# Altium schematic sheet football_main_board_2016.SchDoc
size A3
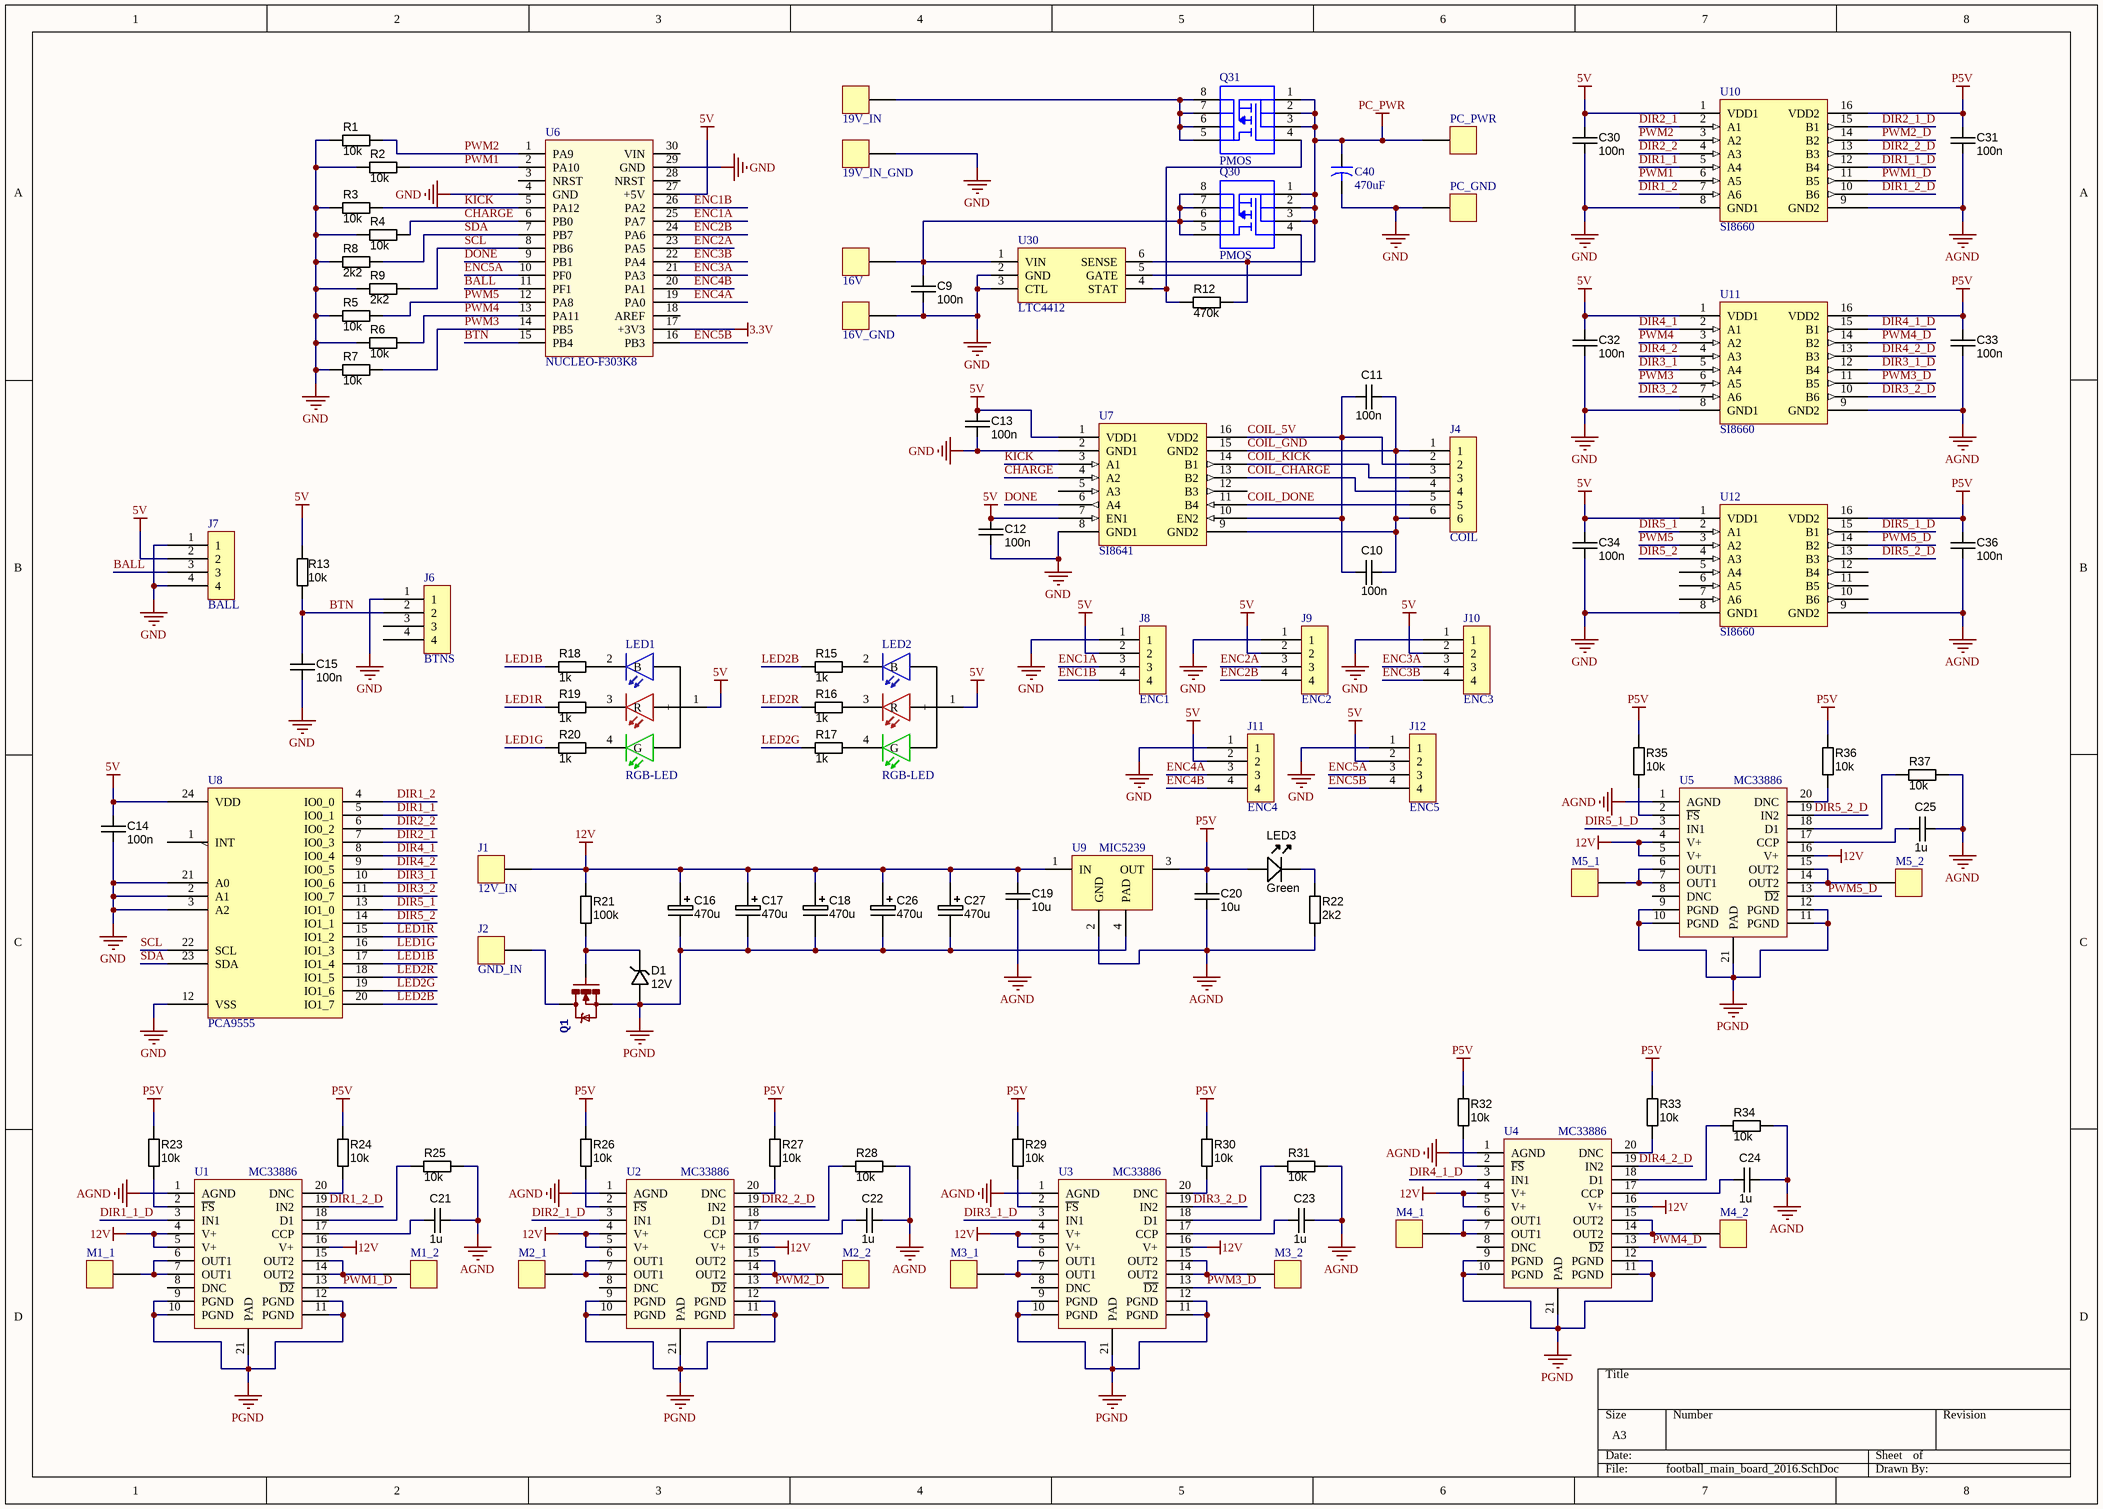
[diagram p0: football_main_board_2016.SchDoc]

## Parts
16V  HEADER-1  [POWER-PAD-4x3]  (value not drawn)
16V_GND  HEADER-1  [POWER-PAD-4x3]  (value not drawn)
19V_IN  HEADER-1  [POWER-PAD-4x3]  (value not drawn)
19V_IN_GND  HEADER-1  [POWER-PAD-4x3]  (value not drawn)
C9  100n  [CAPC1608X90N]
C10  100n  [CAPC1608X90N]
C11  100n  [CAPC1608X90N]
C12  100n  [CAPC1608X90N]
C13  100n  [CAPC1608X90N]
C14  100n  [CAPC1608X90N]
C15  100n  [CAPC1608X90N]
C16  470u  [CAP-LEADED-SMD-5]
C17  470u  [CAP-LEADED-SMD-5]
C18  470u  [CAP-LEADED-SMD-5]
C19  10u  [CAPC3216X180N]
C20  10u  [CAPC3216X180N]
C21  1u  [CAPC1608X90N]
C22  1u  [CAPC1608X90N]
C23  1u  [CAPC1608X90N]
C24  1u  [CAPC1608X90N]
C25  1u  [CAPC1608X90N]
C26  470u  [CAP-LEADED-SMD-5]
C27  470u  [CAP-LEADED-SMD-5]
C30  100n  [CAPC1608X90N]
C31  100n  [CAPC1608X90N]
C32  100n  [CAPC1608X90N]
C33  100n  [CAPC1608X90N]
C34  100n  [CAPC1608X90N]
C36  100n  [CAPC1608X90N]
C40  470uF  [CAPR5-4X5]
D1  12V  [SOD123]
J1  12V_IN  [POWER-PAD]
J2  GND_IN  [POWER-PAD]
J4  COIL  [MICRO-MATCH-6]
J6  BTNS  [MICRO-MATCH-4]
J7  BALL  [MICRO-MATCH-4]
J8  ENC1  [MICRO-MATCH-4]
J9  ENC2  [MICRO-MATCH-4]
J10  ENC3  [MICRO-MATCH-4]
J11  ENC4  [MICRO-MATCH-4]
J12  ENC5  [MICRO-MATCH-4]
LED1  RGB-LED  [RGB-LED]
LED2  RGB-LED  [RGB-LED]
LED3  Green  [LED-0603-GREEN]
M1_1  HEADER-1  [POWER-PAD-4x3]  (value not drawn)
M1_2  HEADER-1  [POWER-PAD-4x3]  (value not drawn)
M2_1  HEADER-1  [POWER-PAD-4x3]  (value not drawn)
M2_2  HEADER-1  [POWER-PAD-4x3]  (value not drawn)
M3_1  HEADER-1  [POWER-PAD-4x3]  (value not drawn)
M3_2  HEADER-1  [POWER-PAD-4x3]  (value not drawn)
M4_1  HEADER-1  [POWER-PAD-4x3]  (value not drawn)
M4_2  HEADER-1  [POWER-PAD-4x3]  (value not drawn)
M5_1  HEADER-1  [POWER-PAD-4x3]  (value not drawn)
M5_2  HEADER-1  [POWER-PAD-4x3]  (value not drawn)
PC_GND  HEADER-1  [POWER-PAD-4x3]  (value not drawn)
PC_PWR  HEADER-1  [POWER-PAD-4x3]  (value not drawn)
Q1  MOSFET-N  [SOT669]  (value not drawn)
Q30  PMOS  [SO8]
Q31  PMOS  [SO8]
R1  10k  [RESC1608X55N]
R2  10k  [RESC1608X55N]
R3  10k  [RESC1608X55N]
R4  10k  [RESC1608X55N]
R5  10k  [RESC1608X55N]
R6  10k  [RESC1608X55N]
R7  10k  [RESC1608X55N]
R8  2k2  [RESC1608X55N]
R9  2k2  [RESC1608X55N]
R12  470k  [RESC1608N_ZERO]
R13  10k  [RESC1608N_ZERO]
R15  1k  [RESC1608N_ZERO]
R16  1k  [RESC1608N_ZERO]
R17  1k  [RESC1608N_ZERO]
R18  1k  [RESC1608N_ZERO]
R19  1k  [RESC1608N_ZERO]
R20  1k  [RESC1608N_ZERO]
R21  100k  [RESC1608X55N]
R22  2k2  [RESC1608X55N]
R23  10k  [RESC1608X55N]
R24  10k  [RESC1608X55N]
R25  10k  [RESC1608X55N]
R26  10k  [RESC1608X55N]
R27  10k  [RESC1608X55N]
R28  10k  [RESC1608X55N]
R29  10k  [RESC1608X55N]
R30  10k  [RESC1608X55N]
R31  10k  [RESC1608X55N]
R32  10k  [RESC1608X55N]
R33  10k  [RESC1608X55N]
R34  10k  [RESC1608X55N]
R35  10k  [RESC1608X55N]
R36  10k  [RESC1608X55N]
R37  10k  [RESC1608X55N]
U1  MC33886  [MC33886]
U2  MC33886  [MC33886]
U3  MC33886  [MC33886]
U4  MC33886  [MC33886]
U5  MC33886  [MC33886]
U6  NUCLEO-F303K8  [NUCLEO-F303K8]
U7  SI8641  [SOIC16]
U8  PCA9555  [TSSOP24]
U9  MIC5239  [SOT230P700X180-4N]
U10  SI8660  [SOIC16]
U11  SI8660  [SOIC16]
U12  SI8660  [SOIC16]
U30  LTC4412  [TSOT-23-6]

## Nets
3.3V: U6.17(+3V3)
5V: C12.2 C13.1 C14.2 C30.1 C32.1 C34.1 J7.2 J8.2 J9.2 J10.2 J11.2 J12.2 LED1.1(+) LED2.1(+) R13.2 U6.27(+5V) U7.1(VDD1) U7.7(EN1) U8.24(VDD) U10.1(VDD1) U11.1(VDD1) U12.1(VDD1)
12V: C16.1 C17.1 C18.1 C19.1 C26.1 C27.1 J1.1 R21.1 U1.4(V+) U1.5(V+) U1.16(V+) U2.4(V+) U2.5(V+) U2.16(V+) U3.4(V+) U3.5(V+) U3.16(V+) U4.4(V+) U4.5(V+) U4.16(V+) U5.4(V+) U5.5(V+) U5.16(V+) U9.1(IN)
AGND: C19.2 C20.2 C21.2 C22.2 C23.2 C24.2 C25.2 C31.2 C33.2 C36.2 R22.2 R25.2 R28.2 R31.2 R34.2 R37.2 U1.1(AGND) U2.1(AGND) U3.1(AGND) U4.1(AGND) U5.1(AGND) U9.2(GND) U10.9(GND2) U11.9(GND2) U12.9(GND2)
GND: 16V_GND.1 19V_IN_GND.1 C9.2 C12.1 C13.2 C14.1 C15.2 C30.2 C32.2 C34.2 C40.2 J6.1 J7.1 J7.4 J8.1 J9.1 J10.1 J11.1 J12.1 PC_GND.1 R1.1 R2.1 R3.1 R4.1 R5.1 R6.1 R7.1 R8.1 R9.1 U6.4(GND) U6.29(GND) U7.2(GND1) U7.8(GND1) U8.2(A1) U8.3(A2) U8.12(VSS) U8.21(A0) U10.8(GND1) U11.8(GND1) U12.8(GND1) U30.2(GND) U30.3(CTL)
P5V: C20.1 C31.1 C33.1 C36.1 LED3.A R23.1 R24.1 R26.1 R27.1 R29.1 R30.1 R32.1 R33.1 R35.1 R36.1 U9.3(OUT) U10.16(VDD2) U11.16(VDD2) U12.16(VDD2)
PC_PWR: C40.1 PC_PWR.1 Q30.1 Q30.2 Q30.3 Q31.1 Q31.2 Q31.3 R12.1 U30.6(SENSE)
PGND: C16.2 C17.2 C18.2 C26.2 C27.2 D1.A Q1.S U1.9(PGND) U1.10(PGND) U1.11(PGND) U1.12(PGND) U1.21(PAD) U2.9(PGND) U2.10(PGND) U2.11(PGND) U2.12(PGND) U2.21(PAD) U3.9(PGND) U3.10(PGND) U3.11(PGND) U3.12(PGND) U3.21(PAD) U4.9(PGND) U4.10(PGND) U4.11(PGND) U4.12(PGND) U4.21(PAD) U5.9(PGND) U5.10(PGND) U5.11(PGND) U5.12(PGND) U5.21(PAD) U9.4(PAD)
BALL: J7.3 U6.11(PF1)
BTN: C15.1 J6.2 R13.1 U6.15(PB4)
CHARGE: R4.2 U6.6(PB0) U7.4(A2)
COIL_5V: C10.1 C11.1 J4.2 U7.10(EN2) U7.16(VDD2)
COIL_CHARGE: J4.4 U7.13(B2)
COIL_DONE: J4.5 U7.11(B4)
COIL_GND: C10.2 C11.2 J4.1 J4.6 U7.9(GND2) U7.15(GND2)
COIL_KICK: J4.3 U7.14(B1)
DIR1_1: U8.5(IO0_1) U10.5(A4)
DIR1_1_D: U1.3(IN1) U10.12(B4)
DIR1_2: U8.4(IO0_0) U10.7(A6)
DIR1_2_D: U1.19(IN2) U10.10(B6)
DIR2_1: U8.7(IO0_3) U10.2(A1)
DIR2_1_D: U2.3(IN1) U10.15(B1)
DIR2_2: U8.6(IO0_2) U10.4(A3)
DIR2_2_D: U2.19(IN2) U10.13(B3)
DIR3_1: U8.10(IO0_6) U11.5(A4)
DIR3_1_D: U3.3(IN1) U11.12(B4)
DIR3_2: U8.11(IO0_7) U11.7(A6)
DIR3_2_D: U3.19(IN2) U11.10(B6)
DIR4_1: U8.8(IO0_4) U11.2(A1)
DIR4_1_D: U4.3(IN1) U11.15(B1)
DIR4_2: U8.9(IO0_5) U11.4(A3)
DIR4_2_D: U4.19(IN2) U11.13(B3)
DIR5_1: U8.13(IO1_0) U12.2(A1)
DIR5_1_D: U5.3(IN1) U12.15(B1)
DIR5_2: U8.14(IO1_1) U12.4(A3)
DIR5_2_D: U5.19(IN2) U12.13(B3)
DONE: U6.9(PB1) U7.6(A4)
ENC1A: J8.3 U6.25(PA7)
ENC1B: J8.4 U6.26(PA2)
ENC2A: J9.3 U6.23(PA5)
ENC2B: J9.4 U6.24(PA6)
ENC3A: J10.3 U6.21(PA3)
ENC3B: J10.4 U6.22(PA4)
ENC4A: J11.3 U6.19(PA0)
ENC4B: J11.4 U6.20(PA1)
ENC5A: J12.3 U6.10(PF0)
ENC5B: J12.4 U6.16(PB3)
KICK: R3.2 U6.5(PA12) U7.3(A1)
LED1B: R18.2 U8.17(IO1_4)
LED1G: R20.2 U8.16(IO1_3)
LED1R: R19.2 U8.15(IO1_2)
LED2B: R15.2 U8.20(IO1_7)
LED2G: R17.2 U8.19(IO1_6)
LED2R: R16.2 U8.18(IO1_5)
PWM1: R2.2 U6.2(PA10) U10.6(A5)
PWM1_D: U1.13(~{D2}) U10.11(B5)
PWM2: R1.2 U6.1(PA9) U10.3(A2)
PWM2_D: U2.13(~{D2}) U10.14(B2)
PWM3: R7.2 U6.14(PB5) U11.6(A5)
PWM3_D: U3.13(~{D2}) U11.11(B5)
PWM4: R6.2 U6.13(PA11) U11.3(A2)
PWM4_D: U4.13(~{D2}) U11.14(B2)
PWM5: R5.2 U6.12(PA8) U12.3(A2)
PWM5_D: U5.13(~{D2}) U12.14(B2)
SCL: R9.2 U6.8(PB6) U8.22(SCL)
SDA: R8.2 U6.7(PB7) U8.23(SDA)
Net16V_1: 16V.1 C9.1 Q30.5 Q30.6 Q30.7 Q30.8 U30.1(VIN)
Net19V_IN_1: 19V_IN.1 Q31.5 Q31.6 Q31.7 Q31.8
NetC21_1: C21.1 U1.17(CCP)
NetC22_1: C22.1 U2.17(CCP)
NetC23_1: C23.1 U3.17(CCP)
NetC24_1: C24.1 U4.17(CCP)
NetC25_1: C25.1 U5.17(CCP)
NetD1_K: D1.K Q1.G R21.2
NetJ2_1: J2.1 Q1.D
NetLED1_2: LED1.2(B) R18.1
NetLED1_3: LED1.3(R) R19.1
NetLED1_4: LED1.4(G) R20.1
NetLED2_2: LED2.2(B) R15.1
NetLED2_3: LED2.3(R) R16.1
NetLED2_4: LED2.4(G) R17.1
NetLED3_K: LED3.K R22.1
NetM1_1_1: M1_1.1 U1.6(OUT1) U1.7(OUT1)
NetM1_2_1: M1_2.1 U1.14(OUT2) U1.15(OUT2)
NetM2_1_1: M2_1.1 U2.6(OUT1) U2.7(OUT1)
NetM2_2_1: M2_2.1 U2.14(OUT2) U2.15(OUT2)
NetM3_1_1: M3_1.1 U3.6(OUT1) U3.7(OUT1)
NetM3_2_1: M3_2.1 U3.14(OUT2) U3.15(OUT2)
NetM4_1_1: M4_1.1 U4.6(OUT1) U4.7(OUT1)
NetM4_2_1: M4_2.1 U4.14(OUT2) U4.15(OUT2)
NetM5_1_1: M5_1.1 U5.6(OUT1) U5.7(OUT1)
NetM5_2_1: M5_2.1 U5.14(OUT2) U5.15(OUT2)
NetQ30_4: Q30.4 U30.5(GATE)
NetQ31_4: Q31.4 R12.2 U30.4(STAT)
NetR23_2: R23.2 U1.2(~{FS})
NetR24_2: R24.2 U1.20(DNC)
NetR25_1: R25.1 U1.18(D1)
NetR26_2: R26.2 U2.2(~{FS})
NetR27_2: R27.2 U2.20(DNC)
NetR28_1: R28.1 U2.18(D1)
NetR29_2: R29.2 U3.2(~{FS})
NetR30_2: R30.2 U3.20(DNC)
NetR31_1: R31.1 U3.18(D1)
NetR32_2: R32.2 U4.2(~{FS})
NetR33_2: R33.2 U4.20(DNC)
NetR34_1: R34.1 U4.18(D1)
NetR35_2: R35.2 U5.2(~{FS})
NetR36_2: R36.2 U5.20(DNC)
NetR37_1: R37.1 U5.18(D1)

Not connected (* = marked no-connect by the designer): J6 3 4; U1 8(DNC); U2 8(DNC); U3 8(DNC); U4 8(DNC); U5 8(DNC); U6 3(NRST) 18(AREF) 28(NRST) 30(VIN); U7 5(A3) 12(B3); U8 1(INT); U12 5(A4) 6(A5) 7(A6) 10(B6) 11(B5) 12(B4)

## Library data of the parts
C9-C15 C21-C25 C30-C34 C36 = CAPC_10n_0603_X7R_50V_10%: Capacitor SMD Cer 10nF 10% 50V X7R 0603; Manufacturer 1: TDK Corporation; Manufacturer Part Number 1: C1608X7R1H103K; Ratings: 50V; X7R; Material: ceramic; SCDType: spec; Value: 10n; Package / Case: 0603 (1608 metric); Tolerance: ±10%; Supplier 1: Digi-Key; Supplier Part Number 1: 445-1311-1-ND; ComponentLink1URL: http://product.tdk.com/capacitor/mlcc/en/documents/mlcc_commercial_general_en.pdf; ComponentLink1Description: http://product.tdk.com/capacitor/mlcc/en/documents/mlcc_commercial_general_en.pdf; Supplier 2: Digi-Key; Supplier Part Number 2: 478-1227-1-ND; Manufacturer 2: AVX Corporation; Manufacturer Part Number 2: 06035C103KAT2A; ComponentLink2URL: http://www.avx.com/docs/Catalogs/cx7r.pdf; ComponentLink2Description: http://www.avx.com/docs/Catalogs/cx7r.pdf
C16-C18 C26 C27 = CAP-ELEC
C19 C20 = CAPC_10u_1206_16V: Capacitor SMD Cer 10uF 10% 16V X7R 1206; Manufacturer 1: Kemet; Manufacturer Part Number 1: C1206C106K4RACTU; Ratings: 16V; X7R; Material: ceramic; SCDType: spec; Value: 10µ; Package / Case: 1206 (3216 metric); Tolerance: ±10%; Supplier 1: Digi-Key; Supplier Part Number 1: 399-3525-1-ND
C40 = Cap2: Capacitor; Value: 100pF; Published: 23-Sep-2002; PackageReference: CAPR5-4X5; Publisher: Altium Limited; PackageDescription: Capacitor; 2 Leads
D1 = DIODE_ZENER_28V_500mW: Diode Zener SMD 28V 0.5W SOD-123; Manufacturer 1: ON Semiconductor; Manufacturer Part Number 1: MMSZ5255BT1G; Ratings: 28V; 0.5W; Material: Si; Tolerance: ±5%; SCDType: source; Package / Case: SOD-123; Diode Type: Zener; Supplier 1: Digi-Key; Supplier Part Number 1: MMSZ5255BT1GOSCT-ND
J1 J2 = HEADER-1
J4 = HEADER-6
J6-J12 = HEADER-4
LED3 = LED_SMD_Green_0603_570nm: LED 0603 SMD Green 570nm 50mcd 20mA; Manufacturer 1: Kingbright Company LLC; Manufacturer Part Number 1: APT1608CGCK; Material: AlGaInP; Ratings: 20mcd min; 50 mcd typ; 570 nm; Voltage - Forward (Vf) Typ: 2.1V; Viewing Angle: 120°; Lens Style/Size: Rectangle with Flat Top, 1.1mm x 0.8mm; Voltage - Forward (Vf) @ 10mA: 2.0V; SCDType: source; Wavelength - Peak: 574nm; Lens Type: Clear; Package / Case: 0603 (1608 metric); Color: Green; Current - Test: 20mA; Supplier 1: Digi-Key; Supplier Part Number 1: 754-1116-1-ND; RoHS 1: RoHS Compliant; Wavelength - Dominant: 570nm; ComponentLink1URL: http://www.us.kingbright.com/images/catalog/SPEC/APT1608CGCK.pdf; ComponentLink1Description: http://www.us.kingbright.com/images/catalog/SPEC/APT1608CGCK.pdf
Q1 = MOSFET-N: PROD_ID: IC-08089
R1-R9 = RES_10K_0603_1%: Resistor SMD chip 10k Ohm 0.1W 1% 0603; Manufacturer 1: Yageo; Manufacturer Part Number 1: RC0603FR-0710KL; Ratings: 1/10W; SCDType: spec; Package / Case: 0603 (1608 Metric); Supplier 1: Digi-Key; Supplier Part Number 1: 311-10.0KHRCT-ND; Tolerance: ±1%; Value: 10K
R12 R13 R15-R20 = RES_0R_0603: Resistor SMD chip 0.0 Ohm 0.1W 0603; Manufacturer 1: Vishay/Dale; Manufacturer Part Number 1: CRCW06030000Z0EA; Tolerance: ±5%; Ratings: 1/10W; SCDType: spec; Value: 0R; Package / Case: 0603 (1608metric); Supplier 1: Digi-Key; Supplier Part Number 1: 541-0.0GCT-ND; ComponentLink1URL: http://www.vishay.com/doc?20035; ComponentLink1Description: http://www.vishay.com/doc?20035; Supplier 2: Digi-Key; Supplier Part Number 2: P0.0GTR-ND; Manufacturer 2: Panasonic Electronic Components; Manufacturer Part Number 2: ERJ-3GEY0R00V; RoHS 2: RoHS Compliant; ComponentLink2URL: http://industrial.panasonic.com/www-cgi/jvcr13pz.cgi?E+PZ+3+AOA0001+ERJ3GEY0R00V+7+WW; ComponentLink2Description: http://industrial.panasonic.com/www-cgi/jvcr13pz.cgi?E+PZ+3+AOA0001+ERJ3GEY0R00V+7+WW; Supplier 3: Digi-Key; Supplier Part Number 3: 311-0.0LECT-ND; Manufacturer 3: Yageo; Manufacturer Part Number 3: AC0603JR-070RL; RoHS 3: RoHS Compliant; ComponentLink3URL: http://www.yageo.com/documents/recent/PYu-AC_51_RoHS_L_2.pdf; ComponentLink3Description: http://www.yageo.com/documents/recent/PYu-AC_51_RoHS_L_2.pdf
R21-R37 = RES_1K_0603_1%: Resistor SMD chip 1k Ohm 0.1W 1% 0603; Manufacturer 1: Yageo; Manufacturer Part Number 1: RC0603FR-071KL; Ratings: 1/10W; SCDType: spec; Package / Case: 0603 (1608 Metric); Supplier 1: Digi-Key; Supplier Part Number 1: 311-1.00KHRCT-ND; Tolerance: ±1%; Value: 1K